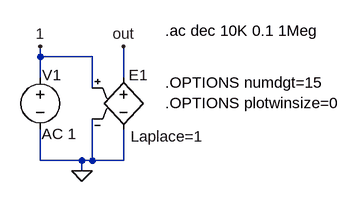
[diagram p0: schematic Fig_2-75_E-Laplace_Test_delta.asc]
Fig_2-75_E-Laplace_Test_delta.asc, the LTspice schematic file:
Version 4
SHEET 1 880 680
WIRE 32 112 32 96
WIRE 112 112 32 112
WIRE 32 144 32 112
WIRE 160 144 160 96
WIRE 112 160 112 112
WIRE 32 272 32 224
WIRE 96 272 32 272
WIRE 112 272 112 208
WIRE 112 272 96 272
WIRE 160 272 160 224
WIRE 160 272 112 272
WIRE 96 288 96 272
FLAG 96 288 0
FLAG 32 96 1
FLAG 160 96 out
SYMBOL e 160 128 R0
WINDOW 3 11 107 Left 2
WINDOW 0 8 12 Left 2
SYMATTR Value Laplace=1
SYMATTR InstName E1
SYMBOL voltage 32 128 R0
WINDOW 0 3 12 Left 2
WINDOW 123 2 103 Left 2
WINDOW 39 0 0 Left 2
SYMATTR InstName V1
SYMATTR Value2 AC 1
SYMATTR Value ""
TEXT 224 72 Left 2 !.ac dec 10K 0.1 1Meg
TEXT 224 152 Left 2 !.OPTIONS numdgt=15\n.OPTIONS plotwinsize=0

The netlist it stands for:
* Fig_2-75_E-Laplace_Test_delta.asc
E1 out 0 1 0 Laplace=1
V1 1 0 AC 1
.ac dec 10K 0.1 1Meg
.OPTIONS numdgt=15
.OPTIONS plotwinsize=0
.backanno
.end